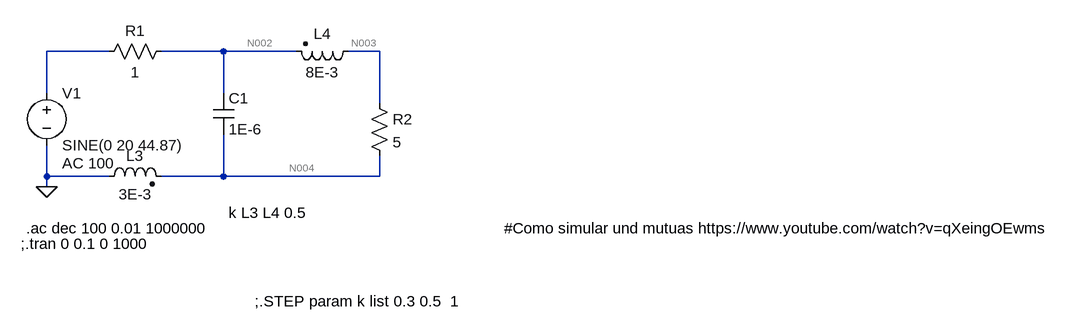
[diagram p0: schematic Draft1.asc]
Draft1.asc, the LTspice schematic file:
Version 4
SHEET 1 1612 680
WIRE 64 80 -32 80
WIRE 240 80 144 80
WIRE 352 80 240 80
WIRE 480 80 432 80
WIRE -32 144 -32 80
WIRE 240 144 240 80
WIRE 480 160 480 80
WIRE -32 272 -32 224
WIRE 64 272 -32 272
WIRE 240 272 240 208
WIRE 240 272 144 272
WIRE 480 272 480 240
WIRE 480 272 240 272
WIRE -32 288 -32 272
FLAG -32 288 0
SYMBOL res 160 64 R90
WINDOW 0 0 56 VBottom 2
WINDOW 3 32 56 VTop 2
SYMATTR InstName R1
SYMATTR Value 1
SYMBOL res 464 144 R0
SYMATTR InstName R2
SYMATTR Value 5
SYMBOL cap 224 144 R0
SYMATTR InstName C1
SYMATTR Value 1E-6
SYMBOL ind2 48 288 R270
WINDOW 0 32 56 VTop 2
WINDOW 3 4 56 VBottom 2
SYMATTR InstName L3
SYMATTR Value 3E-3
SYMBOL ind2 448 64 R90
WINDOW 0 4 56 VBottom 2
WINDOW 3 32 56 VTop 2
SYMATTR InstName L4
SYMATTR Value 8E-3
SYMBOL voltage -32 128 R0
WINDOW 123 24 124 Left 2
WINDOW 39 0 0 Left 0
SYMATTR Value2 AC 100
SYMATTR InstName V1
SYMATTR Value SINE(0 20 44.87)
TEXT 248 328 Left 2 !k L3 L4 0.5
TEXT -64 352 Left 2 !.ac dec 100 0.01 1000000
TEXT 672 352 Left 2 !#Como simular und mutuas https://www.youtube.com/watch?v=qXeingOEwms
TEXT -72 376 Left 2 !;.tran 0 0.1 0 1000
TEXT 288 464 Left 2 !;.STEP param k list 0.3 0.5  1

The netlist it stands for:
* Draft1.asc
R1 N002 N001 1
R2 N003 N004 5
C1 N002 N004 1E-6
L3 0 N004 3E-3
L4 N003 N002 8E-3
V1 N001 0 SINE(0 20 44.87) AC 100
k L3 L4 0.5
.ac dec 100 0.01 1000000
#Como simular und mutuas https://www.youtube.com/watch?v=qXeingOEwms
;.tran 0 0.1 0 1000
;.STEP param k list 0.3 0.5  1
.backanno
.end

* Results of the author's LTspice run, read from the files saved beside the schematic
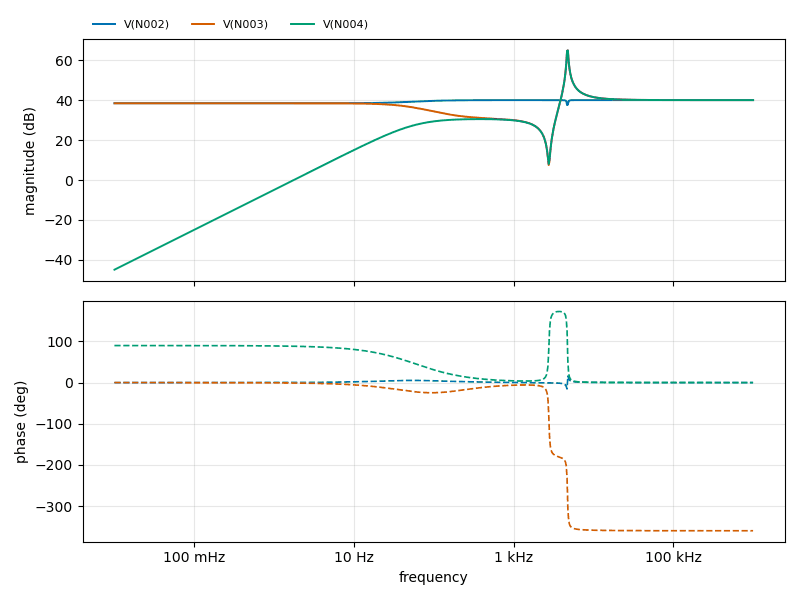
[diagram p1: AC Analysis of Draft1.asc, plotted from the saved traces]
* AC Analysis, 1 run:
*   V(N002): 38.42 dB at 10 mHz, 40.00 dB at 1 MHz, peak 40.00 dB at 1 MHz
*   V(N003): 38.42 dB at 10 mHz, 40.00 dB at 1 MHz, peak 64.86 dB at 4.786 kHz, 3 dB below the peak at 4.631 kHz and 4.847 kHz
*   V(N004): -44.87 dB at 10 mHz, 40.00 dB at 1 MHz, peak 64.87 dB at 4.786 kHz, 3 dB below the peak at 4.631 kHz and 4.847 kHz